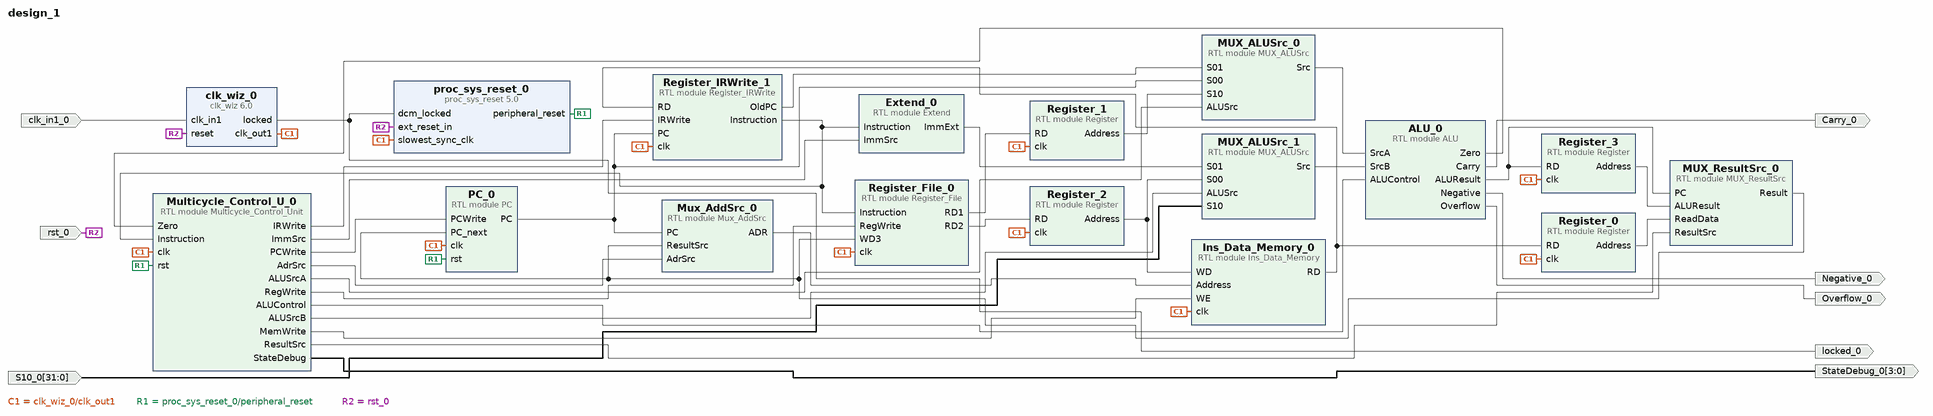
[diagram p0: block diagram of the top level]
# Vivado block design design_1, xc7a12ticsg325-1L, Vivado 2025.2
create_bd_design design_1

create_bd_port -dir I -from 31 -to 0 S10_0
create_bd_port -dir O Carry_0
create_bd_port -dir O Overflow_0
create_bd_port -dir O Negative_0
create_bd_port -dir O -from 3 -to 0 StateDebug_0
create_bd_port -dir O locked_0
create_bd_port -dir I -type clk clk_in1_0
create_bd_port -dir I -type rst rst_0
set_property -dict {CONFIG.POLARITY ACTIVE_HIGH} [get_bd_ports rst_0]

create_bd_cell -type module -reference PC PC_0
create_bd_cell -type module -reference Mux_AddSrc Mux_AddSrc_0
create_bd_cell -type module -reference Ins_Data_Memory Ins_Data_Memory_0
create_bd_cell -type module -reference Register Register_0
create_bd_cell -type module -reference Register_IRWrite Register_IRWrite_1
create_bd_cell -type module -reference Register_File Register_File_0
create_bd_cell -type module -reference Extend Extend_0
create_bd_cell -type module -reference Register Register_1
create_bd_cell -type module -reference Register Register_2
create_bd_cell -type module -reference MUX_ALUSrc MUX_ALUSrc_0
create_bd_cell -type module -reference MUX_ALUSrc MUX_ALUSrc_1
create_bd_cell -type module -reference ALU ALU_0
create_bd_cell -type module -reference Register Register_3
create_bd_cell -type module -reference MUX_ResultSrc MUX_ResultSrc_0
create_bd_cell -type module -reference Multicycle_Control_Unit Multicycle_Control_U_0
create_bd_cell -type ip -vlnv xilinx.com:ip:clk_wiz:6.0 clk_wiz_0
create_bd_cell -type ip -vlnv xilinx.com:ip:proc_sys_reset:5.0 proc_sys_reset_0

# ---- connections ----

connect_bd_net [get_bd_pins ALU_0/ALUResult] [get_bd_pins Register_3/RD] [get_bd_pins MUX_ResultSrc_0/PC]
connect_bd_net [get_bd_pins ALU_0/Carry] [get_bd_ports Carry_0]
connect_bd_net [get_bd_pins ALU_0/Negative] [get_bd_ports Negative_0]
connect_bd_net [get_bd_pins ALU_0/Overflow] [get_bd_ports Overflow_0]
connect_bd_net [get_bd_pins ALU_0/Zero] [get_bd_pins Multicycle_Control_U_0/Zero]
connect_bd_net [get_bd_pins Extend_0/ImmExt] [get_bd_pins MUX_ALUSrc_1/S01]
connect_bd_net [get_bd_pins Ins_Data_Memory_0/RD] [get_bd_pins Register_IRWrite_1/RD] [get_bd_pins Register_0/RD]
connect_bd_net [get_bd_pins MUX_ALUSrc_0/Src] [get_bd_pins ALU_0/SrcA]
connect_bd_net [get_bd_pins MUX_ALUSrc_1/Src] [get_bd_pins ALU_0/SrcB]
connect_bd_net [get_bd_pins MUX_ResultSrc_0/Result] [get_bd_pins PC_0/PC_next] [get_bd_pins Register_File_0/WD3] [get_bd_pins Mux_AddSrc_0/ResultSrc]
connect_bd_net [get_bd_pins Multicycle_Control_U_0/ALUControl] [get_bd_pins ALU_0/ALUControl]
connect_bd_net [get_bd_pins Multicycle_Control_U_0/ALUSrcA] [get_bd_pins MUX_ALUSrc_0/ALUSrc]
connect_bd_net [get_bd_pins Multicycle_Control_U_0/ALUSrcB] [get_bd_pins MUX_ALUSrc_1/ALUSrc]
connect_bd_net [get_bd_pins Multicycle_Control_U_0/AdrSrc] [get_bd_pins Mux_AddSrc_0/AdrSrc]
connect_bd_net [get_bd_pins Multicycle_Control_U_0/IRWrite] [get_bd_pins Register_IRWrite_1/IRWrite]
connect_bd_net [get_bd_pins Multicycle_Control_U_0/ImmSrc] [get_bd_pins Extend_0/ImmSrc]
connect_bd_net [get_bd_pins Multicycle_Control_U_0/MemWrite] [get_bd_pins Ins_Data_Memory_0/WE]
connect_bd_net [get_bd_pins Multicycle_Control_U_0/PCWrite] [get_bd_pins PC_0/PCWrite]
connect_bd_net [get_bd_pins Multicycle_Control_U_0/RegWrite] [get_bd_pins Register_File_0/RegWrite]
connect_bd_net [get_bd_pins Multicycle_Control_U_0/ResultSrc] [get_bd_pins MUX_ResultSrc_0/ResultSrc]
connect_bd_net [get_bd_pins Multicycle_Control_U_0/StateDebug] [get_bd_ports StateDebug_0]
connect_bd_net -net Mux_AddSrc_0_OUT [get_bd_pins Mux_AddSrc_0/ADR] [get_bd_pins Ins_Data_Memory_0/Address]
connect_bd_net [get_bd_pins PC_0/PC] [get_bd_pins Register_IRWrite_1/PC] [get_bd_pins MUX_ALUSrc_0/S00] [get_bd_pins Mux_AddSrc_0/PC]
connect_bd_net [get_bd_pins Register_0/Address] [get_bd_pins MUX_ResultSrc_0/ReadData]
connect_bd_net [get_bd_pins Register_1/Address] [get_bd_pins MUX_ALUSrc_0/S10]
connect_bd_net [get_bd_pins Register_2/Address] [get_bd_pins MUX_ALUSrc_1/S00] [get_bd_pins Ins_Data_Memory_0/WD]
connect_bd_net [get_bd_pins Register_3/Address] [get_bd_pins MUX_ResultSrc_0/ALUResult]
connect_bd_net [get_bd_pins Register_File_0/RD1] [get_bd_pins Register_1/RD]
connect_bd_net [get_bd_pins Register_File_0/RD2] [get_bd_pins Register_2/RD]
connect_bd_net [get_bd_pins Register_IRWrite_1/Instruction] \
  [get_bd_pins Register_File_0/Instruction] [get_bd_pins Extend_0/Instruction] \
  [get_bd_pins Multicycle_Control_U_0/Instruction]
connect_bd_net [get_bd_pins Register_IRWrite_1/OldPC] [get_bd_pins MUX_ALUSrc_0/S01]
connect_bd_net -net S10_0_1 [get_bd_ports S10_0] [get_bd_pins MUX_ALUSrc_1/S10]
connect_bd_net -net clk_in1_0_1 [get_bd_ports clk_in1_0] [get_bd_pins clk_wiz_0/clk_in1]
connect_bd_net [get_bd_pins clk_wiz_0/clk_out1] \
  [get_bd_pins PC_0/clk] [get_bd_pins Register_IRWrite_1/clk] [get_bd_pins Register_0/clk] [get_bd_pins Register_File_0/clk] \
  [get_bd_pins Register_1/clk] [get_bd_pins Register_2/clk] [get_bd_pins Multicycle_Control_U_0/clk] \
  [get_bd_pins Register_3/clk] [get_bd_pins proc_sys_reset_0/slowest_sync_clk] [get_bd_pins Ins_Data_Memory_0/clk]
connect_bd_net [get_bd_pins clk_wiz_0/locked] [get_bd_ports locked_0] [get_bd_pins proc_sys_reset_0/dcm_locked]
connect_bd_net [get_bd_pins proc_sys_reset_0/peripheral_reset] [get_bd_pins PC_0/rst] [get_bd_pins Multicycle_Control_U_0/rst]
connect_bd_net -net rst_0_1 [get_bd_ports rst_0] [get_bd_pins proc_sys_reset_0/ext_reset_in] [get_bd_pins clk_wiz_0/reset]

validate_bd_design
save_bd_design
